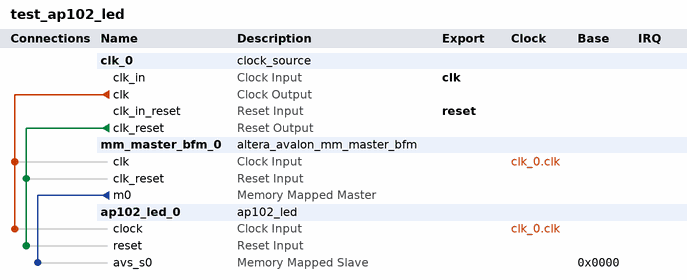
[diagram p0: system contents]
# Platform Designer (Qsys) system test_ap102_led, Cyclone 10 LP 10CL025YU256C8G
# Parameters at their usual value, and those the tool derives, are not listed.
package require -exact qsys 18.1
create_system test_ap102_led
set_project_property DEVICE_FAMILY {Cyclone 10 LP}
set_project_property DEVICE 10CL025YU256C8G

add_instance clk_0 clock_source 18.1
set_instance_parameter_value clk_0 clockFrequency 50000000

add_instance mm_master_bfm_0 altera_avalon_mm_master_bfm 18.1
set_instance_parameter_value mm_master_bfm_0 ADDRESS_UNITS SYMBOLS
set_instance_parameter_value mm_master_bfm_0 AV_ADDRESS_W 32
set_instance_parameter_value mm_master_bfm_0 AV_ALWAYS_BURST_MAX_BURST 0
set_instance_parameter_value mm_master_bfm_0 AV_BURSTCOUNT_W 3
set_instance_parameter_value mm_master_bfm_0 AV_BURST_BNDR_ONLY 1
set_instance_parameter_value mm_master_bfm_0 AV_BURST_LINEWRAP 1
set_instance_parameter_value mm_master_bfm_0 AV_CONSTANT_BURST_BEHAVIOR 1
set_instance_parameter_value mm_master_bfm_0 AV_FIX_READ_LATENCY 1
set_instance_parameter_value mm_master_bfm_0 AV_MAX_PENDING_WRITES 0
set_instance_parameter_value mm_master_bfm_0 AV_NUMSYMBOLS 4
set_instance_parameter_value mm_master_bfm_0 AV_READRESPONSE_W 8
set_instance_parameter_value mm_master_bfm_0 AV_READ_WAIT_TIME 1
set_instance_parameter_value mm_master_bfm_0 AV_WRITERESPONSE_W 8
set_instance_parameter_value mm_master_bfm_0 USE_BURSTCOUNT 1
set_instance_parameter_value mm_master_bfm_0 USE_BYTE_ENABLE 1
set_instance_parameter_value mm_master_bfm_0 USE_READ 1
set_instance_parameter_value mm_master_bfm_0 USE_READ_DATA 1
set_instance_parameter_value mm_master_bfm_0 USE_READ_DATA_VALID 1
set_instance_parameter_value mm_master_bfm_0 USE_WAIT_REQUEST 1
set_instance_parameter_value mm_master_bfm_0 VHDL_ID 0

add_instance ap102_led_0 ap102_led 1.0
set_instance_parameter_value ap102_led_0 number_leds 8

# connections
add_connection clk_0.clk ap102_led_0.clock clock
add_connection clk_0.clk mm_master_bfm_0.clk clock
add_connection clk_0.clk_reset ap102_led_0.reset reset
add_connection clk_0.clk_reset mm_master_bfm_0.clk_reset reset
add_connection mm_master_bfm_0.m0 ap102_led_0.avs_s0 avalon
set_connection_parameter_value mm_master_bfm_0.m0/ap102_led_0.avs_s0 baseAddress 0x0000

# exported interfaces
add_interface clk clock sink
set_interface_property clk EXPORT_OF clk_0.clk_in
add_interface reset reset sink
set_interface_property reset EXPORT_OF clk_0.clk_in_reset

set_interconnect_requirement {$system} qsys_mm.clockCrossingAdapter HANDSHAKE
set_interconnect_requirement {$system} qsys_mm.enableEccProtection FALSE
set_interconnect_requirement {$system} qsys_mm.insertDefaultSlave FALSE
set_interconnect_requirement {$system} qsys_mm.maxAdditionalLatency 1

save_system test_ap102_led.qsys
